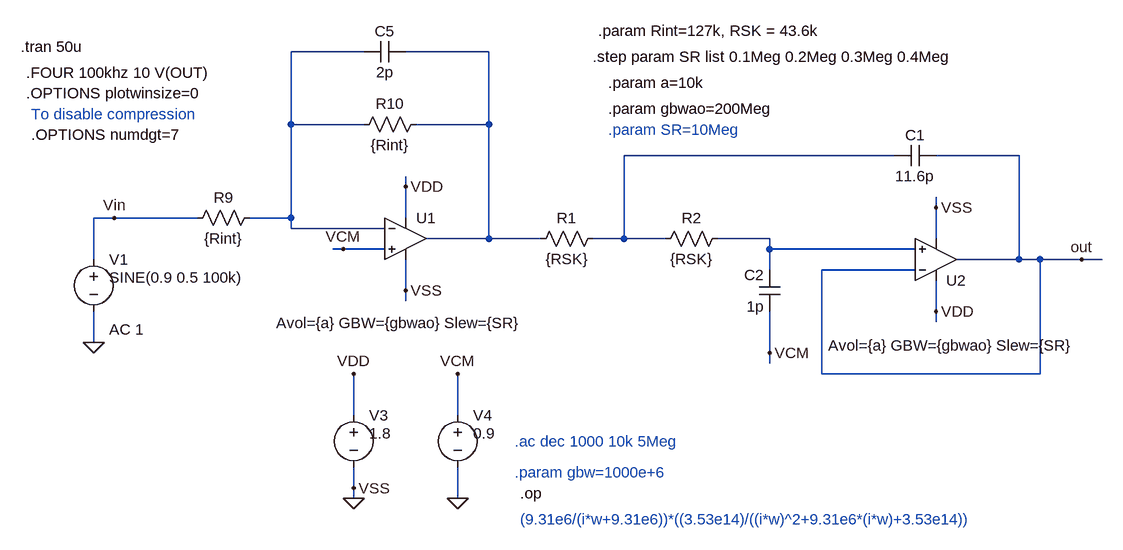
[diagram p0: schematic FTJ_ord3_SallenKey_AOmodel_efectSR.asc]
FTJ_ord3_SallenKey_AOmodel_efectSR.asc, the LTspice schematic file:
Version 4
SHEET 1 2932 1708
WIRE 1440 -144 1328 -144
WIRE 1632 -144 1504 -144
WIRE 1328 -32 1328 -144
WIRE 1440 -32 1328 -32
WIRE 1632 -32 1632 -144
WIRE 1632 -32 1520 -32
WIRE 2256 16 1840 16
WIRE 2448 16 2320 16
WIRE 1504 64 1504 48
WIRE 2320 96 2320 80
WIRE 1056 112 1024 112
WIRE 1184 112 1056 112
WIRE 1328 112 1328 -32
WIRE 1328 112 1264 112
WIRE 1504 112 1504 64
WIRE 1328 128 1328 112
WIRE 1472 128 1328 128
WIRE 1632 144 1632 -32
WIRE 1632 144 1536 144
WIRE 1712 144 1632 144
WIRE 1840 144 1840 16
WIRE 1840 144 1792 144
WIRE 1904 144 1840 144
WIRE 2064 144 1984 144
WIRE 2320 144 2320 96
WIRE 1408 160 1392 160
WIRE 1472 160 1408 160
WIRE 2064 160 2064 144
WIRE 2288 160 2064 160
WIRE 1024 176 1024 112
WIRE 2448 176 2448 16
WIRE 2448 176 2352 176
WIRE 2480 176 2448 176
WIRE 2544 176 2480 176
WIRE 2576 176 2544 176
WIRE 2064 192 2064 160
WIRE 2288 192 2144 192
WIRE 1504 224 1504 176
WIRE 1504 240 1504 224
WIRE 2320 256 2320 208
WIRE 2320 272 2320 256
WIRE 1024 304 1024 256
WIRE 2064 320 2064 256
WIRE 2064 336 2064 320
WIRE 2144 352 2144 192
WIRE 2480 352 2480 176
WIRE 2480 352 2144 352
WIRE 1424 416 1424 352
WIRE 1584 416 1584 352
WIRE 1424 528 1424 496
WIRE 1424 544 1424 528
WIRE 1584 544 1584 496
FLAG 2544 176 out
FLAG 1424 544 0
FLAG 1584 544 0
FLAG 1424 352 VDD
FLAG 1584 352 VCM
FLAG 1424 528 VSS
FLAG 2064 320 VCM
FLAG 1504 224 VSS
FLAG 1504 64 VDD
FLAG 1408 160 VCM
FLAG 2320 96 VSS
FLAG 2320 256 VDD
FLAG 1024 304 0
FLAG 1056 112 Vin
DATAFLAG 1632 -96 ""
SYMBOL cap 2320 0 R90
WINDOW 0 0 32 VBottom 2
WINDOW 3 32 32 VTop 2
SYMATTR InstName C1
SYMATTR Value 11.6p
SYMBOL voltage 1424 400 R0
WINDOW 123 24 124 Left 2
WINDOW 39 0 0 Left 2
WINDOW 3 24 44 Left 2
SYMATTR Value 1.8
SYMATTR InstName V3
SYMBOL voltage 1584 400 R0
WINDOW 123 24 124 Left 2
WINDOW 39 0 0 Left 2
WINDOW 3 24 44 Left 2
SYMATTR Value 0.9
SYMATTR InstName V4
SYMBOL res 1808 128 R90
WINDOW 0 0 56 VBottom 2
WINDOW 3 32 56 VTop 2
SYMATTR InstName R1
SYMATTR Value {RSK}
SYMBOL res 1280 96 R90
WINDOW 0 0 56 VBottom 2
WINDOW 3 32 56 VTop 2
SYMATTR InstName R9
SYMATTR Value {Rint}
SYMBOL cap 1504 -160 R90
WINDOW 0 0 32 VBottom 2
WINDOW 3 32 32 VTop 2
SYMATTR InstName C5
SYMATTR Value 2p
SYMBOL res 1536 -48 R90
WINDOW 0 0 56 VBottom 2
WINDOW 3 32 56 VTop 2
SYMATTR InstName R10
SYMATTR Value {Rint}
SYMBOL res 2000 128 R90
WINDOW 0 0 56 VBottom 2
WINDOW 3 32 56 VTop 2
SYMATTR InstName R2
SYMATTR Value {RSK}
SYMBOL cap 2080 256 R180
WINDOW 0 24 56 Left 2
WINDOW 3 24 8 Left 2
SYMATTR InstName C2
SYMATTR Value 1p
SYMBOL Opamps\\UniversalOpamp2 1504 144 R0
WINDOW 123 -199 130 Left 2
SYMATTR Value2 Avol={a} GBW={gbwao} Slew={SR}
SYMATTR InstName U1
SYMBOL Opamps\\UniversalOpamp2 2320 176 M180
WINDOW 123 -166 -132 Left 2
SYMATTR Value2 Avol={a} GBW={gbwao} Slew={SR}
SYMATTR InstName U2
SYMBOL voltage 1024 160 R0
WINDOW 123 24 124 Left 2
WINDOW 39 0 0 Left 2
WINDOW 3 24 44 Left 2
SYMATTR Value2 AC 1
SYMATTR Value SINE(0.9 0.5 100k)
SYMATTR InstName V1
TEXT 1672 456 Left 2 ;.ac dec 1000 10k 5Meg
TEXT 1672 504 Left 2 ;.param gbw=1000e+6
TEXT 1680 536 Left 2 !.op
TEXT 1680 576 Left 2 ;(9.31e6/(i*w+9.31e6))*((3.53e14)/((i*w)^2+9.31e6*(i*w)+3.53e14))
TEXT 1800 -176 Left 2 !.param Rint=127k, RSK = 43.6k
TEXT 912 -152 Left 2 !.tran 50u
TEXT 1816 -96 Left 2 !.param a=10k
TEXT 1816 -56 Left 2 !.param gbwao=200Meg
TEXT 1816 -24 Left 2 ;.param SR=10Meg
TEXT 920 -112 Left 2 !.FOUR 100khz 10 V(OUT)
TEXT 920 -80 Left 2 !.OPTIONS plotwinsize=0
TEXT 928 -48 Left 2 ;To disable compression
TEXT 928 -16 Left 2 !.OPTIONS numdgt=7
TEXT 1792 -136 Left 2 !.step param SR list 0.1Meg 0.2Meg 0.3Meg 0.4Meg

The netlist it stands for:
* FTJ_ord3_SallenKey_AOmodel_efectSR.asc
C1 out N003 11.6p
V3 VDD 0 1.8
V4 VCM 0 0.9
R1 N003 N002 {RSK}
R9 N001 Vin {Rint}
C5 N002 N001 2p
R10 N002 N001 {Rint}
R2 N004 N003 {RSK}
C2 VCM N004 1p
XU1 VCM N001 VDD 0 N002 level.2 Avol={a} GBW={gbwao} Slew={SR} ilimit=25m rail=0 Vos=0 phimargin=45 en=0 enk=0 in=0 ink=0 Rin=500Meg  ; pins IN+ IN- V+ V- OUT
XU2 N004 out VDD 0 out level.2 Avol={a} GBW={gbwao} Slew={SR} ilimit=25m rail=0 Vos=0 phimargin=45 en=0 enk=0 in=0 ink=0 Rin=500Meg  ; pins IN+ IN- V+ V- OUT
V1 Vin 0 SINE(0.9 0.5 100k) AC 1
* .ac dec 1000 10k 5Meg
* .param gbw=1000e+6
.op
* (9.31e6/(i*w+9.31e6))*((3.53e14)/((i*w)^2+9.31e6*(i*w)+3.53e14))
.param Rint=127k, RSK = 43.6k
.tran 50u
.param a=10k
.param gbwao=200Meg
* .param SR=10Meg
.FOUR 100khz 10 V(OUT)
.OPTIONS plotwinsize=0
* To disable compression
.OPTIONS numdgt=7
.step param SR list 0.1Meg 0.2Meg 0.3Meg 0.4Meg
.lib UniversalOpamps2.sub
.backanno
.end